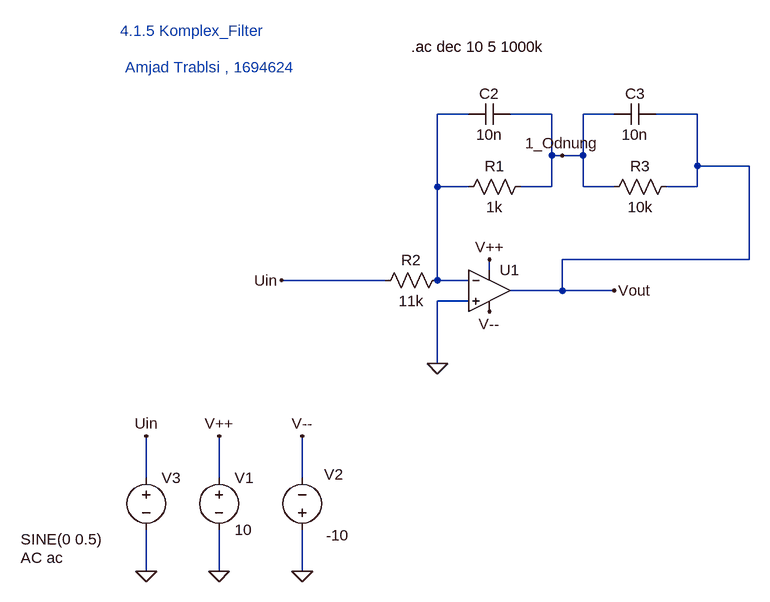
[diagram p0: schematic Komplex_Filter_1.asc]
Komplex_Filter_1.asc, the LTspice schematic file:
Version 4
SHEET 1 880 680
WIRE 352 -128 304 -128
WIRE 480 -128 416 -128
WIRE 576 -128 528 -128
WIRE 704 -128 640 -128
WIRE 480 -64 480 -128
WIRE 496 -64 480 -64
WIRE 528 -64 528 -128
WIRE 528 -64 496 -64
WIRE 704 -48 704 -128
WIRE 784 -48 704 -48
WIRE 304 -16 304 -128
WIRE 352 -16 304 -16
WIRE 480 -16 480 -64
WIRE 480 -16 432 -16
WIRE 528 -16 528 -64
WIRE 576 -16 528 -16
WIRE 704 -16 704 -48
WIRE 704 -16 656 -16
WIRE 784 96 784 -48
WIRE 784 96 496 96
WIRE 384 112 384 96
WIRE 224 128 64 128
WIRE 304 128 304 -16
WIRE 352 128 304 128
WIRE 496 144 496 96
WIRE 496 144 416 144
WIRE 576 144 496 144
WIRE 352 160 304 160
WIRE 304 256 304 160
WIRE -144 432 -144 368
WIRE -32 432 -32 368
WIRE 96 432 96 368
WIRE -144 576 -144 512
WIRE -32 576 -32 512
WIRE 96 576 96 512
FLAG -32 576 0
FLAG -32 368 V++
FLAG 384 96 V++
FLAG 96 576 0
FLAG 96 368 V--
FLAG 384 176 V--
FLAG 576 144 Vout
FLAG -144 576 0
FLAG -144 368 Uin
FLAG 64 128 Uin
FLAG 304 256 0
FLAG 496 -64 1_Odnung
SYMBOL res 448 -32 R90
WINDOW 0 0 56 VBottom 2
WINDOW 3 32 56 VTop 2
SYMATTR InstName R1
SYMATTR Value 1k
SYMBOL voltage -32 416 R0
WINDOW 123 0 0 Left 0
WINDOW 39 0 0 Left 0
SYMATTR InstName V1
SYMATTR Value 10
SYMBOL voltage 96 528 R180
WINDOW 0 -63 101 Left 2
WINDOW 3 -72 7 Left 2
WINDOW 123 0 0 Left 0
WINDOW 39 0 0 Left 0
SYMATTR InstName V2
SYMATTR Value -10
SYMBOL voltage -144 416 R0
WINDOW 3 -193 111 Left 2
WINDOW 123 -193 139 Left 2
WINDOW 39 0 0 Left 0
SYMATTR Value SINE(0 0.5)
SYMATTR Value2 AC ac
SYMATTR InstName V3
SYMBOL res 320 112 R90
WINDOW 0 0 56 VBottom 2
WINDOW 3 32 56 VTop 2
SYMATTR InstName R2
SYMATTR Value 11k
SYMBOL cap 416 -144 R90
WINDOW 0 0 32 VBottom 2
WINDOW 3 32 32 VTop 2
SYMATTR InstName C2
SYMATTR Value 10n
SYMBOL res 672 -32 R90
WINDOW 0 0 56 VBottom 2
WINDOW 3 32 56 VTop 2
SYMATTR InstName R3
SYMATTR Value 10k
SYMBOL cap 640 -144 R90
WINDOW 0 0 32 VBottom 2
WINDOW 3 32 32 VTop 2
SYMATTR InstName C3
SYMATTR Value 10n
SYMBOL OpAmps/UniversalOpAmp 384 144 R0
SYMATTR InstName U1
TEXT -184 -256 Left 2 ;4.1.5 Komplex_Filter
TEXT 264 -232 Left 2 !.ac dec 10 5 1000k
TEXT -176 -200 Left 2 ;Amjad Trablsi , 1694624

The netlist it stands for:
* Komplex_Filter_1.asc
R1 1_Odnung N001 1k
V1 V++ 0 10
V2 0 V-- -10
V3 Uin 0 SINE(0 0.5) AC ac
R2 N001 Uin 11k
C2 1_Odnung N001 10n
R3 Vout 1_Odnung 10k
C3 Vout 1_Odnung 10n
XU1 0 N001 V++ V-- Vout level1 Avol=1Meg GBW=10Meg Vos=0 En=0 Enk=0 In=0 Ink=0 Rin=500Meg  ; pins In+ In- V+ V- OUT
* 4.1.5 Komplex_Filter
.ac dec 10 5 1000k
* Amjad Trablsi , 1694624
.lib UniversalOpAmp1.lib
.backanno
.end